# EAGLE design Crockoft-Walton_01 (EAGLE 7.2.0)
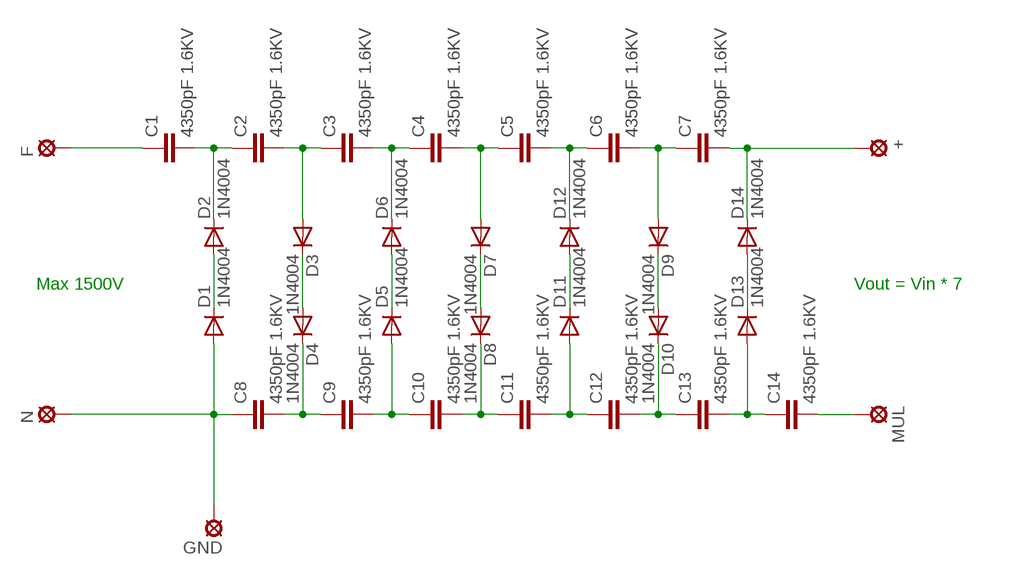
[diagram p0: schematic, sheet 1]

## Parts
+  LSP13  [LSP13]
C1  4350pF 1.6KV  C-EU225-074X268  [C225-074X268]
C2  4350pF 1.6KV  C-EU225-074X268  [C225-074X268]
C3  4350pF 1.6KV  C-EU225-074X268  [C225-074X268]
C4  4350pF 1.6KV  C-EU225-074X268  [C225-074X268]
C5  4350pF 1.6KV  C-EU225-074X268  [C225-074X268]
C6  4350pF 1.6KV  C-EU225-074X268  [C225-074X268]
C7  4350pF 1.6KV  C-EU225-074X268  [C225-074X268]
C8  4350pF 1.6KV  C-EU225-074X268  [C225-074X268]
C9  4350pF 1.6KV  C-EU225-074X268  [C225-074X268]
C10  4350pF 1.6KV  C-EU225-074X268  [C225-074X268]
C11  4350pF 1.6KV  C-EU225-074X268  [C225-074X268]
C12  4350pF 1.6KV  C-EU225-074X268  [C225-074X268]
C13  4350pF 1.6KV  C-EU225-074X268  [C225-074X268]
C14  4350pF 1.6KV  C-EU225-074X268  [C225-074X268]
D1  1N4004  [DO41-10]
D2  1N4004  [DO41-10]
D3  1N4004  [DO41-10]
D4  1N4004  [DO41-10]
D5  1N4004  [DO41-10]
D6  1N4004  [DO41-10]
D7  1N4004  [DO41-10]
D8  1N4004  [DO41-10]
D9  1N4004  [DO41-10]
D10  1N4004  [DO41-10]
D11  1N4004  [DO41-10]
D12  1N4004  [DO41-10]
D13  1N4004  [DO41-10]
D14  1N4004  [DO41-10]
F  LSP13  [LSP13]
GND  LSP13  [LSP13]
MUL  LSP13  [LSP13]
N  LSP13  [LSP13]

## Nets
N$1: C1.2 C2.1 D2.C
N$2: C2.2 C3.1 D3.A
N$3: C3.2 C4.1 D6.C
N$4: C4.2 C5.1 D7.A
N$5: C5.2 C6.1 D12.C
N$6: C6.2 C7.1 D9.A
N$7: C8.2 C9.1 D4.C
N$8: C9.2 C10.1 D5.A
N$9: C10.2 C11.1 D8.C
N$10: C11.2 C12.1 D11.A
N$11: C12.2 C13.1 D10.C
N$12: C13.2 C14.1 D13.A
N$13: D1.C D2.A
N$14: D3.C D4.A
N$15: D5.C D6.A
N$16: D7.C D8.A
N$17: D9.C D10.A
N$18: D11.C D12.A
N$19: D13.C D14.A
N$20: C8.1 D1.A GND.MP N.MP
N$21: +.MP C7.2 D14.C
N$22: C14.2 MUL.MP
N$23: C1.1 F.MP

## Notes on the sheet
- Max 1500V | Vout = Vin * 7

## Library data of the parts
+ F GND MUL N = solpad:LSP13: SOLDER PAD drill 1.3 mm, distributor Buerklin, 12H562
C1-C14 = rcl:C-EU: CAPACITOR, European symbol
D1-D14 = adafruit:1N4004: DIODE General purpose 1N400x type rectifier (With bigger pads) http://www.ladyada.net/library/pcb/eaglelibrary.html

## Board
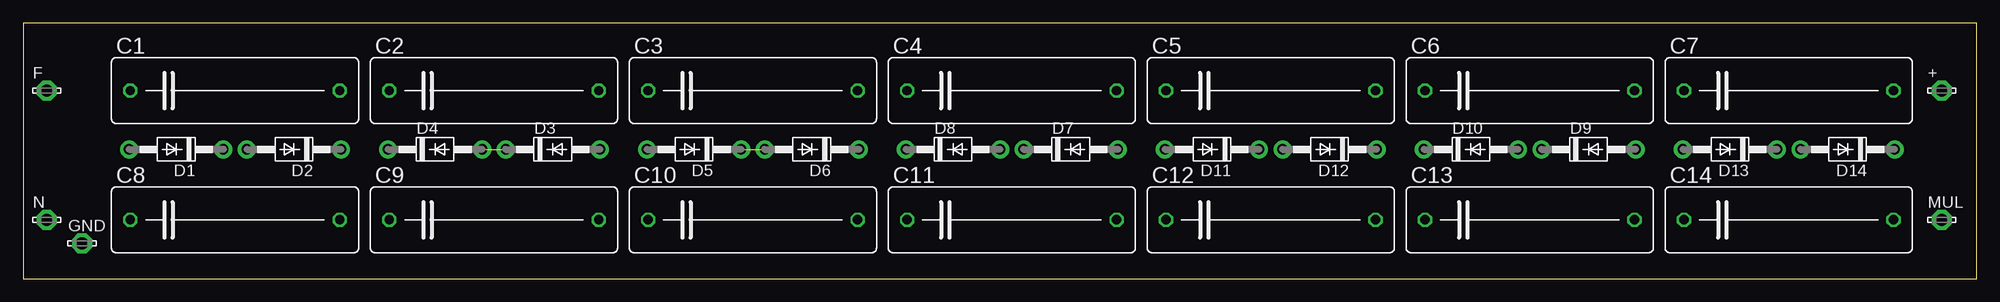
[diagram p1: board, top side]
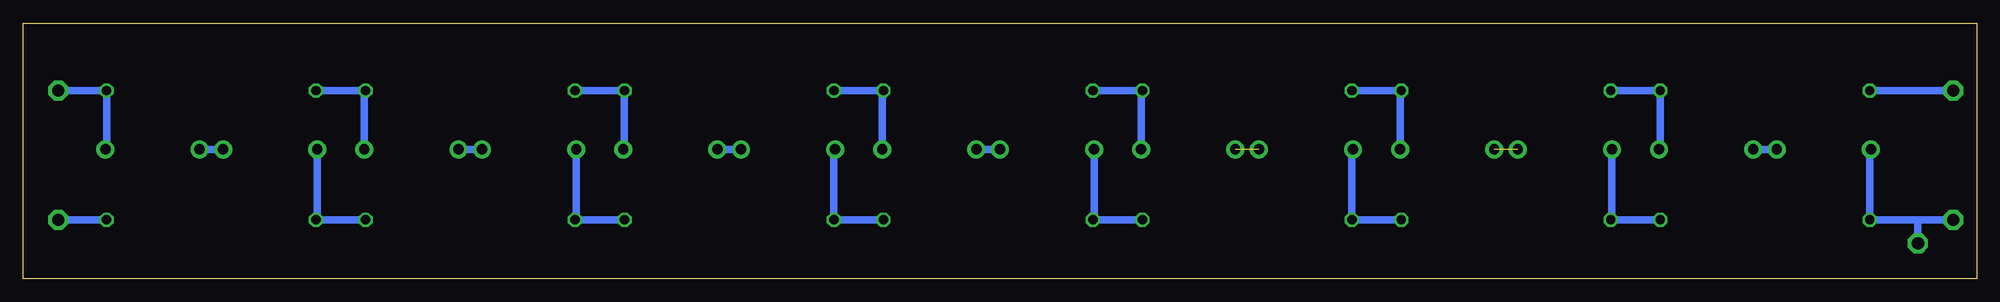
[diagram p2: board, bottom side, seen from below]

Size 210.8 x 27.61 mm. Coordinates in mm from the lower left corner, seen from the top.
Outline: 0,0 210.8,0 210.8,27.61 0,27.61 0,0
Copper layers (1*16): Top 0.035mm / dielectric 1.5mm / Bottom 0.035mm
Design rules "default": minimum track width 10mil, minimum drill 24mil, track to track 8mil, track to pad 8mil, pad to pad 8mil, via to via 8mil, smd to smd 8mil, copper to edge 40mil, drill to drill 8mil, minimum pad ring 10mil, minimum via ring 8mil, stop-mask expansion 4mil, vias tented up to drill 0mil, thermal gap 10mil

### Footprints (pad centres in the part's own frame; a part is rotated, then mirrored left to right if it is on the bottom)
LSP13 = drill 1.321 pad 2.159 octagon: MP 0,0
C225-074X268 = drill 1.016 octagon: 1 -11.303,0; 2 11.303,0
DO41-10 = drill 1.118 pad 1.93: A 5.08,0; C -5.08,0

### Placement (x,y rotation side)
+  207.01,20.32 0 top
C1  22.86,20.32 0 top
C2  50.8,20.32 0 top
C3  78.74,20.32 0 top
C4  106.68,20.32 0 top
C5  134.62,20.32 0 top
C6  162.56,20.32 0 top
C7  190.5,20.32 0 top
C8  22.86,6.35 0 top
C9  50.8,6.35 0 top
C10  78.74,6.35 0 top
C11  106.68,6.35 0 top
C12  134.62,6.35 0 top
C13  162.56,6.35 0 top
C14  190.5,6.35 0 top
D1  16.51,13.97 180 top
D2  29.21,13.97 180 top
D3  57.15,13.97 0 top
D4  44.45,13.97 0 top
D5  72.39,13.97 180 top
D6  85.09,13.97 180 top
D7  113.03,13.97 0 top
D8  100.33,13.97 0 top
D9  168.91,13.97 0 top
D10  156.21,13.97 0 top
D11  128.27,13.97 180 top
D12  140.97,13.97 180 top
D13  184.15,13.97 180 top
D14  196.85,13.97 180 top
F  2.54,20.32 0 top
GND  6.35,3.81 0 top
MUL  207.01,6.35 0 top
N  2.54,6.35 0 top

### Tracks (layer width: path | path; a pad name or v marks a point on that pad's centre or on a via)
N$1
  Bottom 0.813: C2.1 C1.2 34.16,13.97 D2.C
N$2
  Bottom 0.813: C3.1 C2.2 62.23,20.32 D3.A
N$3
  Bottom 0.813: C3.2 90.17,20.32 | 90.17,20.32 C4.1 | D6.C 90.17,20.32
N$4
  Bottom 0.813: C5.1 C4.2 118.11,20.32 D7.A
N$5
  Bottom 0.813: C6.1 C5.2 145.92,13.97 D12.C
N$6
  Bottom 0.813: C7.1 C6.2 173.99,20.32 D9.A
N$7
  Bottom 0.813: C8.2 C9.1 39.37,6.35 D4.C
N$8
  Bottom 0.813: D5.A 67.44,13.97 C10.1 C9.2
N$9
  Bottom 0.813: C10.2 C11.1 95.25,6.35 D8.C
N$10
  Bottom 0.813: D11.A 123.32,13.97 C12.1 C11.2
N$11
  Bottom 0.813: C12.2 C13.1 151.13,6.35 D10.C
N$12
  Bottom 0.813: C13.2 C14.1 179.07,6.35 D13.A
N$13
  Bottom 0.813: D1.C D2.A
N$14  (1 unrouted)
N$15  (1 unrouted)
N$16
  Bottom 0.813: D8.A D7.C
N$17
  Bottom 0.813: D9.C D10.A
N$18
  Bottom 0.813: D12.A D11.C
N$19
  Bottom 0.813: D13.C D14.A
N$20
  Bottom 0.813: D1.A 11.56,13.97 C8.1 6.35,6.35 | 6.35,6.35 N.MP | GND.MP 6.35,6.35
N$21
  Bottom 0.813: +.MP C7.2 201.8,13.97 D14.C
N$22
  Bottom 0.813: MUL.MP C14.2
N$23
  Bottom 0.813: F.MP C1.1